# Altium schematic sheet ATmega32M1.SchDoc
size A4
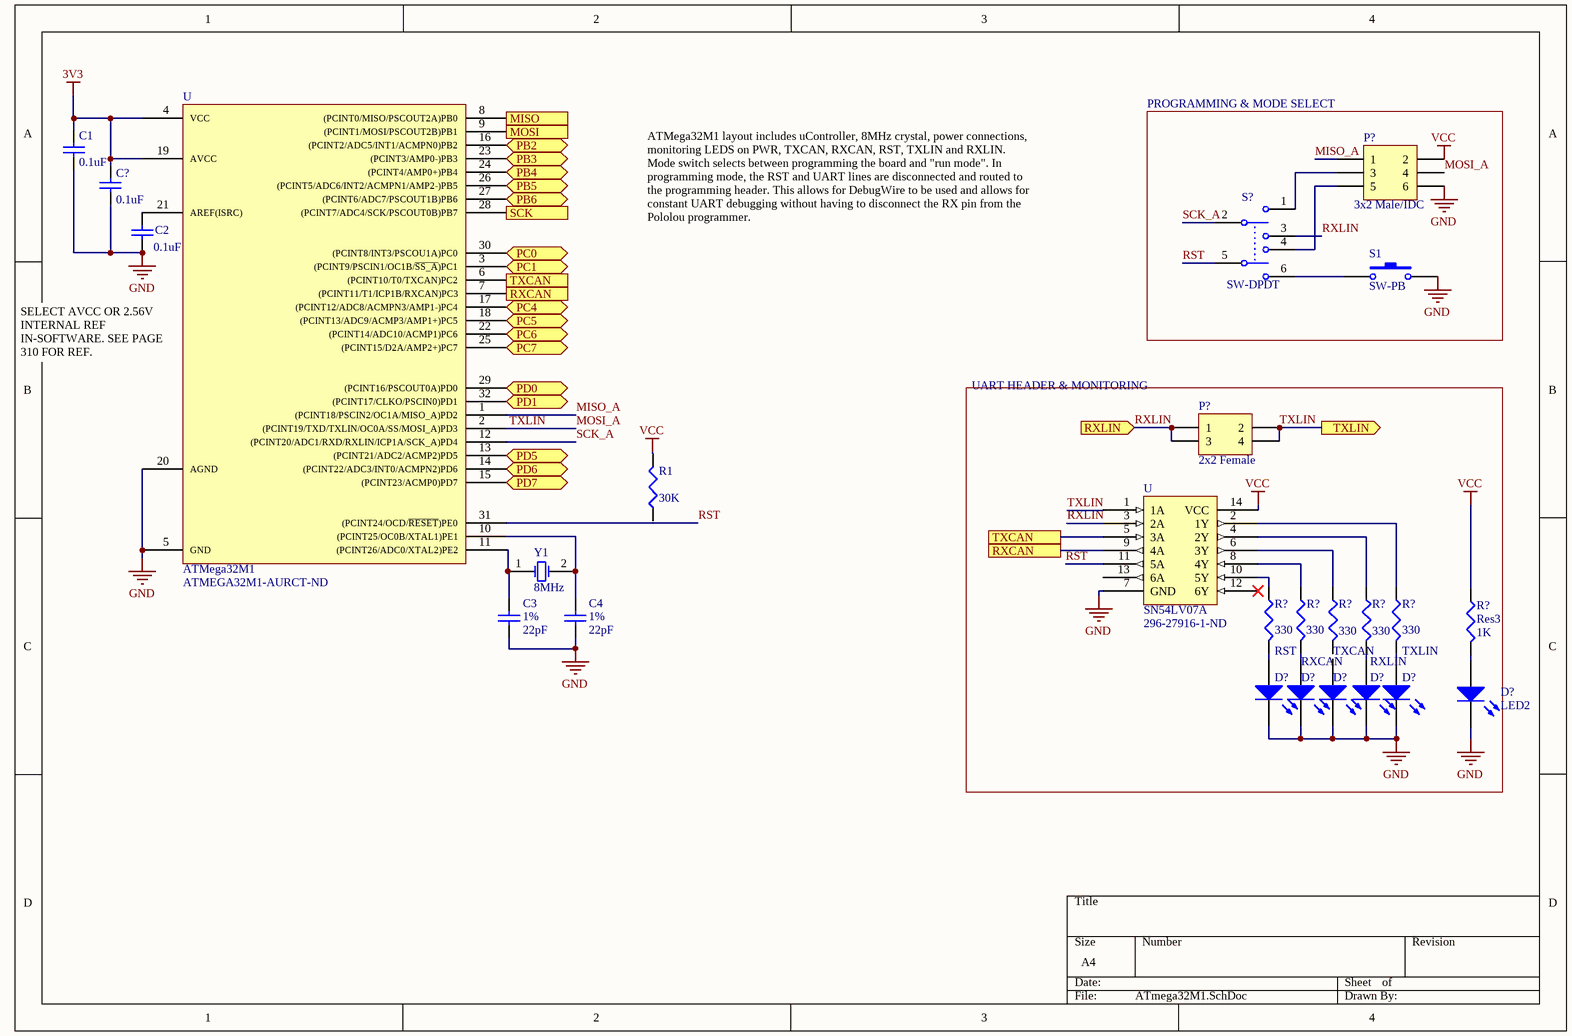
[diagram p0: ATmega32M1.SchDoc]

## Parts
(Parts that share a designator on the sheet are numbered #1, #2 ... from top to bottom, then left to right.)
C1  value 0.1uF  [C1206]  (hidden comment: Cap Semi)
C2  value 0.1uF  [C1206]  (hidden comment: Cap Semi)
C3  1%  value 22pF  [C1206]
C4  1%  value 22pF  [C1206]
C?  value 0.1uF  [C1206]  (hidden comment: Cap Semi)
D?#1  RST  [3.2X1.6X1.1]
D?#2  RXCAN  [3.2X1.6X1.1]
D?#3  TXCAN  [3.2X1.6X1.1]
D?#4  RXLIN  [3.2X1.6X1.1]
D?#5  TXLIN  [3.2X1.6X1.1]
D?#6  LED2  [3.2X1.6X1.1]
P?#1  3x2 Male/IDC  [HDR2X3]
P?#2  2x2 Female  [HDR2X2]
R1  value 30K  [J1-0603]
R?#1  value 330  [J1-0603]  (hidden comment: Res3)
R?#2  value 330  [J1-0603]  (hidden comment: Res3)
R?#3  value 330  [J1-0603]  (hidden comment: Res3)
R?#4  value 330  [J1-0603]  (hidden comment: Res3)
R?#5  value 330  [J1-0603]  (hidden comment: Res3)
R?#6  Res3  value 1K  [J1-0603]
S1  SW-PB  [SPST-2]
S?  SW-DPDT  [PCBComponent_1]
U#1  ATMega32M1  Supplier Part Number 1: ATMEGA32M1-AURCT-ND  [QFP80P900X900X120-32N]
U#2  SN54LV07A  Supplier Part Number: 296-27916-1-ND  [SOT402-1_N]
Y1  8MHz  [R38]

## Blocks framed on the sheet
PROGRAMMING & MODE SELECT: P?#1 S1 S?
UART HEADER & MONITORING: D?#1-D?#6 P?#2 R?#1-R?#6 U#2

## Ports
MISO (in), MOSI (out), PB2 (bidir), PB3 (bidir), PB4 (bidir), PB5 (bidir), PB6 (bidir), PC0 (bidir), PC1 (bidir), PC4 (bidir), PC5 (bidir), PC6 (bidir), PC7 (bidir), PD0 (bidir), PD1 (bidir), PD5 (bidir), PD6 (bidir), PD7 (bidir), RXCAN, RXCAN (in), RXLIN (in), SCK (out), TXCAN, TXCAN (out), TXLIN (out)

## Nets
3V3: C1.2 C?.2 U#1.4(VCC) U#1.19(AVCC)
GND: C1.1 C2.2 C3.1 C4.1 C?.1 D?#1.2(K) D?#2.2(K) D?#3.2(K) D?#4.2(K) D?#5.2(K) D?#6.2(K) P?#1.6 S1.2 U#1.5(GND) U#1.20(AGND) U#2.7(GND)
VCC: P?#1.2 R1.2 R?#6.1 U#2.14(VCC)
MISO: U#1.8((PCINT0/MISO/PSCOUT2A)PB0) ; port MISO
MISO_A: P?#1.1 U#1.1((PCINT18/PSCIN2/OC1A/MISO_A)PD2)
MOSI: U#1.9((PCINT1/MOSI/PSCOUT2B)PB1) ; port MOSI
MOSI_A: P?#1.4 P?#2.2 P?#2.4 U#1.2((PCINT19/TXD/TXLIN/OC0A/SS/MOSI_A)PD3) U#2.1(1A) ; port TXLIN  [also labelled TXLIN]
PB2: U#1.16((PCINT2/ADC5/INT1/ACMPN0)PB2) ; port PB2
PB3: U#1.23((PCINT3/AMP0-)PB3) ; port PB3
PB4: U#1.24((PCINT4/AMP0+)PB4) ; port PB4
PB5: U#1.26((PCINT5/ADC6/INT2/ACMPN1/AMP2-)PB5) ; port PB5
PB6: U#1.27((PCINT6/ADC7/PSCOUT1B)PB6) ; port PB6
PC0: U#1.30((PCINT8/INT3/PSCOU1A)PC0) ; port PC0
PC1: U#1.3((PCINT9/PSCIN1/OC1B/~{SS_A})PC1) ; port PC1
PC4: U#1.17((PCINT12/ADC8/ACMPN3/AMP1-)PC4) ; port PC4
PC5: U#1.18((PCINT13/ADC9/ACMP3/AMP1+)PC5) ; port PC5
PC6: U#1.22((PCINT14/ADC10/ACMP1)PC6) ; port PC6
PC7: U#1.25((PCINT15/D2A/AMP2+)PC7) ; port PC7
PD0: U#1.29((PCINT16/PSCOUT0A)PD0) ; port PD0
PD1: U#1.32((PCINT17/CLKO/PSCIN0)PD1) ; port PD1
PD5: U#1.13((PCINT21/ADC2/ACMP2)PD5) ; port PD5
PD6: U#1.14((PCINT22/ADC3/INT0/ACMPN2)PD6) ; port PD6
PD7: U#1.15((PCINT23/ACMP0)PD7) ; port PD7
RST: S?.5 U#1.31((PCINT24/OCD/~{RESET})PE0) U#2.11(5A)
RXCAN: U#1.7((PCINT11/T1/ICP1B/RXCAN)PC3) U#2.9(4A) ; port RXCAN
RXLIN: P?#2.1 P?#2.3 S?.3 U#2.3(2A) ; port RXLIN
SCK: U#1.28((PCINT7/ADC4/SCK/PSCOUT0B)PB7) ; port SCK
SCK_A: S?.2 U#1.12((PCINT20/ADC1/RXD/RXLIN/ICP1A/SCK_A)PD4)
TXCAN: U#1.6((PCINT10/T0/TXCAN)PC2) U#2.5(3A) ; port TXCAN
NetC2_1: C2.1 U#1.21(AREF(ISRC))
NetC3_2: C3.2 U#1.11((PCINT26/ADC0/XTAL2)PE2) Y1.1(OSC1)
NetC4_2: C4.2 U#1.10((PCINT25/OC0B/XTAL1)PE1) Y1.2(OSC2)
NetD?#1_1: D?#1.1(A) R?#1.2
NetD?#2_1: D?#2.1(A) R?#2.2
NetD?#4_1: D?#4.1(A) R?#4.2
NetD?#5_1: D?#5.1(A) R?#5.2
NetD?#6_1: D?#6.1(A) R?#6.2
NetP?#1_3: P?#1.3 S?.1
NetP?#1_5: P?#1.5 S?.4
NetR?#1_1: R?#1.1 U#2.10(5Y)
NetR?#2_1: R?#2.1 U#2.8(4Y)
NetR?#3_1: R?#3.1 U#2.6(3Y)
NetR?#4_1: R?#4.1 U#2.4(2Y)
NetR?#5_1: R?#5.1 U#2.2(1Y)
NetS1_1: S1.1 S?.6

Not connected (* = marked no-connect by the designer): D?#3 1(A); R1 1; R?#3 2; U#2 12(6Y)* 13(6A)

## Notes on the sheet
- ATMega32M1 layout includes uController, 8MHz crystal, power connections, monitoring LEDS on PWR, TXCAN, RXCAN, RST, TXLIN and RXLIN. Mode switch selects between programming the board and "run mode". In programming mode, the RST and UART lines are disconnected and routed to the programming header. This allows for DebugWire to be used and allows for constant UART debugging without having to disconnect the RX pin from the Pololou programmer.
- (near U#1) SELECT AVCC OR 2.56V INTERNAL REF IN-SOFTWARE. SEE PAGE 310 FOR REF.

## Library data of the parts
C1-C4 C? = Cap Semi: Capacitor (Semiconductor SIM Model); Published: 8-Jun-2000; LatestRevisionDate: 29-May-2009; LatestRevisionNote: IPC-7351 Footprint Added.; PackageReference: C1206; Publisher: Altium Limited; PackageDescription: Chip Capacitor
D?#1-D?#6 = LED2: Typical RED, GREEN, YELLOW, AMBER GaAs LED; Published: 8-Jun-2000; LatestRevisionDate: 17-Jul-2002; LatestRevisionNote: Re-released for DXP Platform.; PackageVersion: Feb-2002; PackageReference: 3.2X1.6X1.1; Publisher: Altium Limited; PackageDescription: SM LED; 2 Flat Leads
P?#1 = Header 3X2: 2x3 through-hole programming header, IDC; LatestRevisionDate: 17-Jul-2002; LatestRevisionNote: Re-released for DXP Platform.; Publisher: Altium Limited
P?#2 = Header 2X2: Header, 2-Pin, Dual row; LatestRevisionDate: 17-Jul-2002; LatestRevisionNote: Re-released for DXP Platform.; Publisher: Altium Limited
R1 = Res3: 30K Pull-up resistor for RST. See page; Published: 8-Jun-2000; LatestRevisionDate: 29-May-2009; LatestRevisionNote: IPC-7351 Footprint Added.; PackageReference: J1-0603; Publisher: Altium Limited; PackageDescription: Chip Resistor
R?#1-R?#6 = Res3: Resistor; Published: 8-Jun-2000; LatestRevisionDate: 29-May-2009; LatestRevisionNote: IPC-7351 Footprint Added.; PackageReference: J1-0603; Publisher: Altium Limited; PackageDescription: Chip Resistor
S1 = SW-PB: Switch; Published: 24-Mar-1999; LatestRevisionDate: 17-Jul-2002; LatestRevisionNote: Re-released for DXP Platform.; PackageReference: SPST-2; Publisher: Altium Limited; PackageDescription: Switch; 2 Leads
S? = SW-DPDT: Double-Pole, Double-Throw Switch; Published: 24-Mar-1999; LatestRevisionDate: 17-Jul-2002; LatestRevisionNote: Re-released for DXP Platform.; PackageReference: DPDT-6; Publisher: Altium Limited; PackageDescription: Switch; 6 Leads; Supplier Part Number: 401-2001-ND; Supplier: Digi-Key
U#1 = ATMega32M1: Atmel 8-bit AVR microcontroller.; Supplier 1: Digi-Key
U#2 = SN54LV07A: Six element 1-bit non-inverting open-drain buffer.; Supplier: Digi-Key
Y1 = XTAL: Crystal Oscillator; Published: 8-Jun-2000; LatestRevisionDate: 17-Jul-2002; LatestRevisionNote: Re-released for DXP Platform.; PackageReference: R38; Publisher: Altium Limited; PackageDescription: Crystal, Thru-Hole; 2 Leads; Body 3.1 x 8.2 mm (Dia.xH); Supplier 1: Digi-Key; Supplier Part Number 1: 535-13456-6-ND